# Altium project MiniRobot.PrjPcb
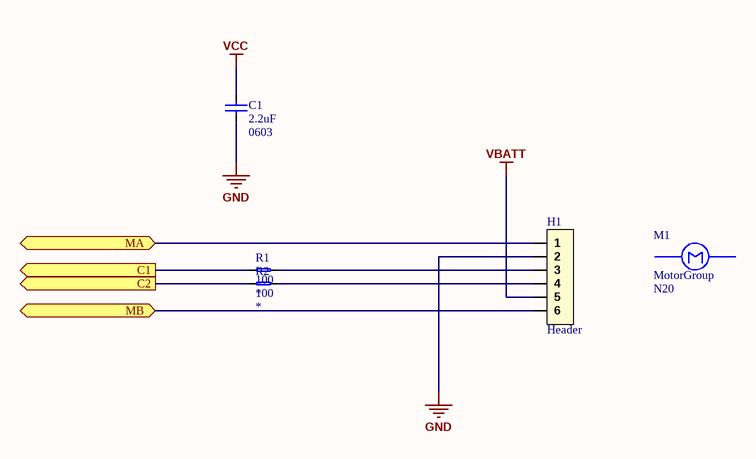
[diagram p0: MR_Motor.SchDoc]
5 sheets, 26 parts. Net scope: flat (ports and power ports of the same name join across sheets).
Board file: MiniRobot.PcbDoc
Sheets:
  MR_Motor.SchDoc
  MR_Motor_Control.SchDoc
  MR_Power.SchDoc
  MR_UartConnector.SchDoc
  MR_RangeSensor.SchDoc

## Sheet MR_Motor.SchDoc
size A4; CompanyName: BeeIonic; SheetNumber: 2; SheetTotal: 7

### Parts
(Parts that share a designator on the sheet are numbered #1, #2 ... from top to bottom, then left to right.)
C1#1  value 2.2uF  Package: 0603  [0603_CAP_LD]  (hidden comment: CerCap)
H1  Header  [HEADER_1X6_PICOBLADE_653106124022]
M1  MotorGroup  Reference: N20  [MotorGroup]
R1#1  value 100  [0603_RES_LD]  (hidden comment: Resistor)
R2#1  value 100  [0603_RES_LD]  (hidden comment: Resistor)

### Ports
C1 (out), C2 (out), MA (bidir), MB (bidir)

### Nets
GND: C1#1.1 H1.2
VBATT: H1.5
VCC: C1#1.2
NetH1_1: H1.1 ; port MA
NetH1_3: H1.3 R1#1.2
NetH1_4: H1.4 R2#1.2
NetH1_6: H1.6 ; port MB
NetR1#1_1: R1#1.1 ; port C1
NetR2#1_1: R2#1.1 ; port C2

### Notes on the sheet
- Project :
- Title :
- Sheet:
- of
- Creation Date :
- Designer :
- Modified Date :

### Library data of the parts
C1#1 = CerCap: Ceramic Capacitor; Type: *; Voltage/Power: *
H1 = Header_6x1: Header 6x1 Pins
M1 = Motor
R1#1 R2#1 = Resistor: Precision: *; Package: *

## Sheet MR_Motor_Control.SchDoc
size A4; CompanyName: BeeIonic; SheetNumber: 3; SheetTotal: 7
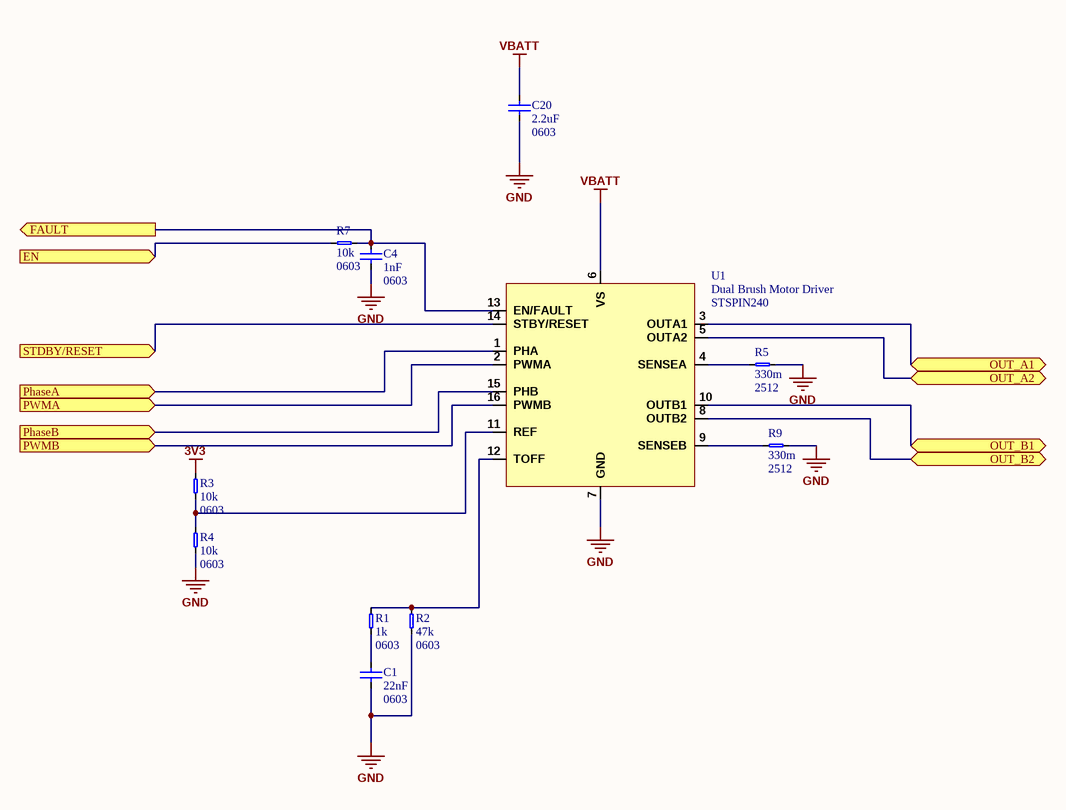
[diagram p1: MR_Motor_Control.SchDoc]

### Parts
(Parts that share a designator on the sheet are numbered #1, #2 ... from top to bottom, then left to right.)
C1#2  value 22nF  Package: 0603  [0603_CAP_LD]  (hidden comment: CerCap)
C4  value 1nF  Package: 0603  [0603_CAP_LD]  (hidden comment: CerCap)
C20  value 2.2uF  Package: 0603  [0603_CAP_LD]  (hidden comment: CerCap)
R1#2  value 1k  Package: 0603  [0603_RES_LD]  (hidden comment: Resistor)
R2#2  value 47k  Package: 0603  [0603_RES_LD]  (hidden comment: Resistor)
R3  value 10k  Package: 0603  [0603_RES_LD]  (hidden comment: Resistor)
R4  value 10k  Package: 0603  [0603_RES_LD]  (hidden comment: Resistor)
R5  value 330m  Package: 2512  [2512_RES_LD]  (hidden comment: Resistor)
R7  value 10k  Package: 0603  [0603_RES_LD]  (hidden comment: Resistor)
R9  value 330m  Package: 2512  [2512_RES_LD]  (hidden comment: Resistor)
U1  Dual Brush Motor Driver  [QFN-STSPIN240]

### Ports
EN (in), FAULT (out), OUT_A1 (bidir), OUT_A2 (bidir), OUT_B1 (bidir), OUT_B2 (bidir), PhaseA (in), PhaseB (in), PWMA (in), PWMB (in), STDBY/RESET (in)

### Nets
3V3: R3.2
GND: C1#2.1 C4.1 C20.1 R2#2.1 R4.1 R5.2 R9.2 U1.7(GND)
VBATT: C20.2 U1.6(VS)
NetC1#2_2: C1#2.2 R1#2.1
NetC4_2: C4.2 R7.2 U1.13(EN/FAULT) ; port FAULT
NetR1#2_2: R1#2.2 R2#2.2 U1.12(TOFF)
NetR3_1: R3.1 R4.2 U1.11(REF)
NetR5_1: R5.1 U1.4(SENSEA)
NetR7_1: R7.1 ; port EN
NetR9_1: R9.1 U1.9(SENSEB)
NetU1_1: U1.1(PHA) ; port PhaseA
NetU1_2: U1.2(PWMA) ; port PWMA
NetU1_3: U1.3(OUTA1) ; port OUT_A1
NetU1_5: U1.5(OUTA2) ; port OUT_A2
NetU1_8: U1.8(OUTB2) ; port OUT_B2
NetU1_10: U1.10(OUTB1) ; port OUT_B1
NetU1_14: U1.14(STBY/RESET) ; port STDBY/RESET
NetU1_15: U1.15(PHB) ; port PhaseB
NetU1_16: U1.16(PWMB) ; port PWMB

### Notes on the sheet
- Project :
- Title :
- Sheet:
- of
- Creation Date :
- Designer :
- Modified Date :

### Library data of the parts
C1#2 C4 C20 = CerCap: Ceramic Capacitor; Type: *; Voltage/Power: *
U1 = STSPIN240: ST Dual Motor Driver; Reference: STSPIN240
R1#2 R2#2 R3-R5 R7 R9 = Resistor: Precision: *

## Sheet MR_Power.SchDoc
size A4; CompanyName: BeeIonic; SheetNumber: 5; SheetTotal: 7
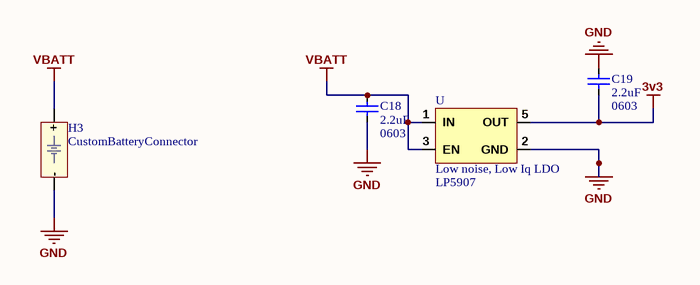
[diagram p2: MR_Power.SchDoc]

### Parts
C18  value 2.2uF  Package: 0603  [0603_CAP_LD]  (hidden comment: CerCap)
C19  value 2.2uF  Package: 0603  [0603_CAP_LD]  (hidden comment: CerCap)
H3  CustomBatteryConnector  [CustomBatteryConnector]
U  Low noise, Low Iq LDO  [LP5907]

### Nets
3V3: C19.1 U.5(OUT)
GND: C18.1 C19.2 H3.- U.2(GND)
VBATT: C18.2 H3.+ U.1(IN) U.3(EN)

Not connected (* = marked no-connect by the designer): U 4(NC)

### Notes on the sheet
- Project :
- Title :
- Sheet:
- of
- Creation Date :
- Designer :
- Modified Date :

### Library data of the parts
C18 C19 = CerCap: Ceramic Capacitor; Type: *; Voltage/Power: *
H3 = BatteryConnector: Custom Battery Connector
U = LP5907: LP5907 Low Noise Low Iq LDO; Reference: LP5907

## Sheet MR_UartConnector.SchDoc
size A4; CompanyName: BeeIonic; SheetNumber: 7; SheetTotal: 7
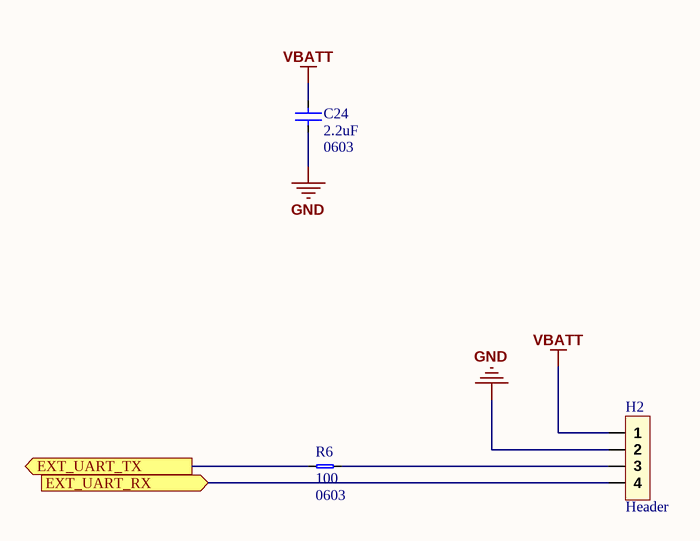
[diagram p3: MR_UartConnector.SchDoc]

### Parts
C24  value 2.2uF  Package: 0603  [0603_CAP_LD]  (hidden comment: CerCap)
H2  Header  [HE14 1x4 Straight]
R6  value 100  Package: 0603  [0603_RES_LD]  (hidden comment: Resistor)

### Ports
EXT_UART_RX (in), EXT_UART_TX (out)

### Nets
GND: C24.1 H2.2
VBATT: C24.2 H2.1
NetH2_3: H2.3 R6.2
NetH2_4: H2.4 ; port EXT_UART_RX
NetR6_1: R6.1 ; port EXT_UART_TX

### Notes on the sheet
- Project :
- Title :
- Sheet:
- of
- Creation Date :
- Designer :
- Modified Date :

### Library data of the parts
C24 = CerCap: Ceramic Capacitor; Type: *; Voltage/Power: *
H2 = Header_4x1: Header 4x1 PIns
R6 = Resistor: Precision: *

## Sheet MR_RangeSensor.SchDoc
size A4; CompanyName: BeeIonic; SheetNumber: 6; SheetTotal: 7
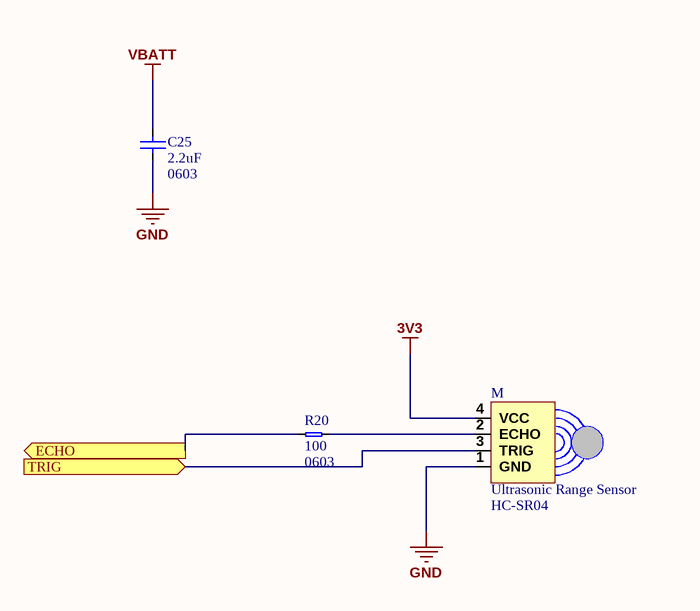
[diagram p4: MR_RangeSensor.SchDoc]

### Parts
C25  value 2.2uF  Package: 0603  [0603_CAP_LD]  (hidden comment: CerCap)
M  Ultrasonic Range Sensor  [HC-SR04]
R20  value 100  Package: 0603  [0603_RES_LD]  (hidden comment: Resistor)

### Ports
ECHO (out), TRIG (in)

### Nets
3V3: M.4(VCC)
GND: C25.1 M.1(GND)
VBATT: C25.2
NetM_2: M.2(ECHO) R20.2
NetM_3: M.3(TRIG) ; port TRIG
NetR20_1: R20.1 ; port ECHO

### Notes on the sheet
- Project :
- Title :
- Sheet:
- of
- Creation Date :
- Designer :
- Modified Date :

### Library data of the parts
C25 = CerCap: Ceramic Capacitor; Type: *; Voltage/Power: *
M = HC-SR04: Reference: HC-SR04
R20 = Resistor: Precision: *

## Nets that join several sheets
3V3: MR_Motor_Control (R3.2), MR_Power (C19.1 U.5), MR_RangeSensor (M.4)
GND: MR_Motor (C1#1.1 H1.2), MR_Motor_Control (8 pins), MR_Power (C18.1 C19.2 H3.- U.2), MR_UartConnector (C24.1 H2.2), MR_RangeSensor (C25.1 M.1)
VBATT: MR_Motor (H1.5), MR_Motor_Control (C20.2 U1.6), MR_Power (C18.2 H3.+ U.1 U.3), MR_UartConnector (C24.2 H2.1), MR_RangeSensor (C25.2)